# Altium schematic sheet K4S561632.SchDoc
size A
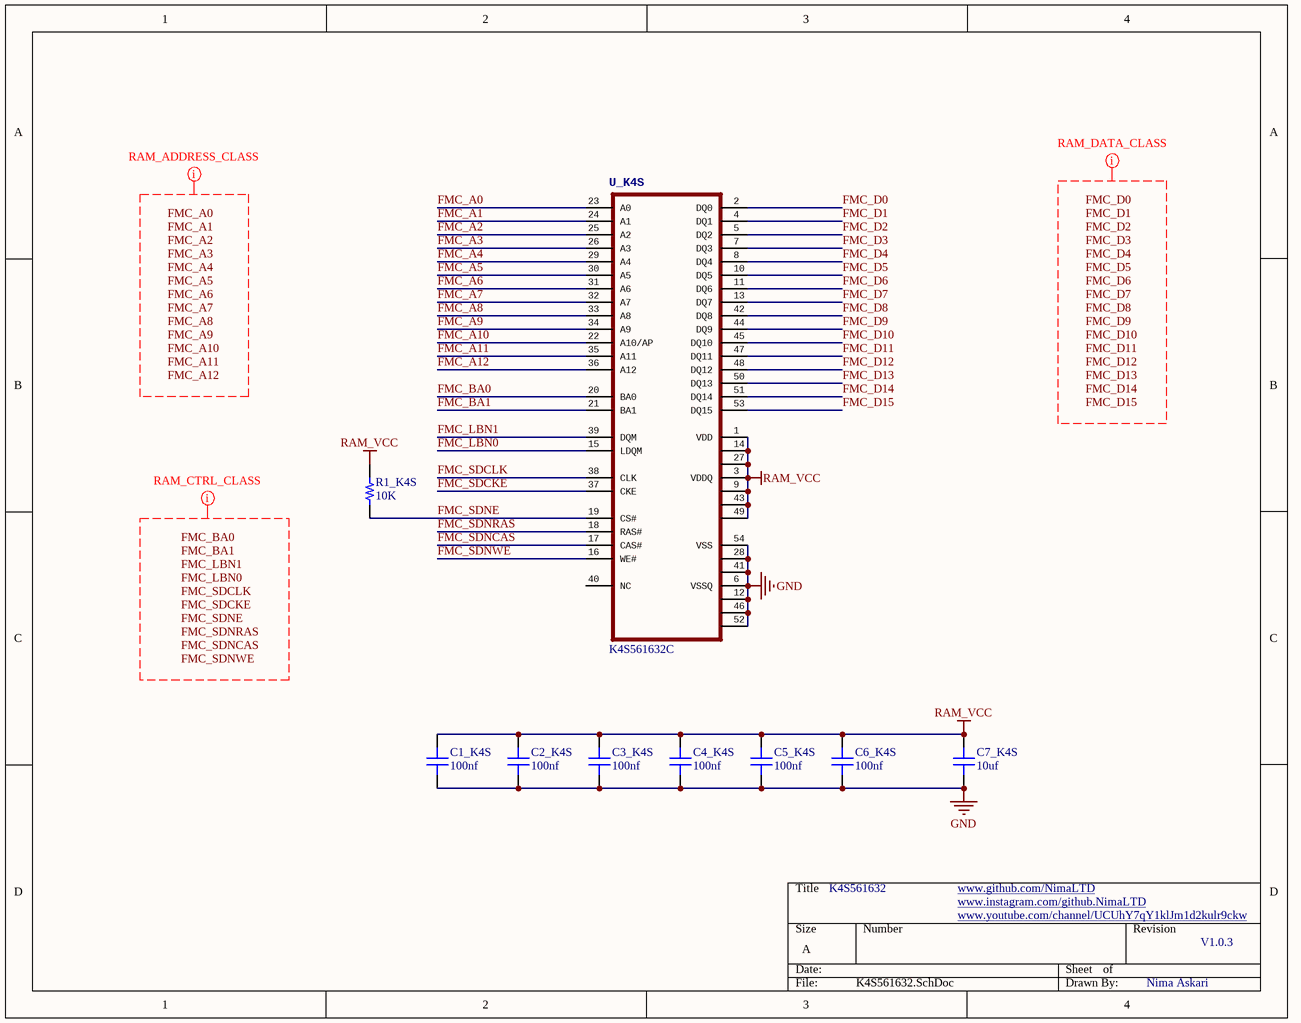
[diagram p0: K4S561632.SchDoc]

## Parts
C1_K4S  100nf  [CAP 0805]
C2_K4S  100nf  [CAP 0805]
C3_K4S  100nf  [CAP 0805]
C4_K4S  100nf  [CAP 0805]
C5_K4S  100nf  [CAP 0805]
C6_K4S  100nf  [CAP 0805]
C7_K4S  10uf  [CAP 0805]
R1_K4S  10K  [RES 0805]
U_K4S  MP: K4S561632C  [TSOP54_P0.8]  (hidden comment: SDRAM   4M x 16bit x 4 banks synchronous DRAM. 256 Mbit SDRAM.)

## Nets
GND: C1_K4S.1 C2_K4S.1 C3_K4S.1 C4_K4S.1 C5_K4S.1 C6_K4S.1 C7_K4S.1 U_K4S.6(VSSQ) U_K4S.12(VSSQ@12) U_K4S.28(VSS@28) U_K4S.41(VSS@41) U_K4S.46(VSSQ@46) U_K4S.52(VSSQ@52) U_K4S.54(VSS)
RAM_VCC: C1_K4S.2 C2_K4S.2 C3_K4S.2 C4_K4S.2 C5_K4S.2 C6_K4S.2 C7_K4S.2 R1_K4S.2 U_K4S.1(VDD) U_K4S.3(VDDQ) U_K4S.9(VDDQ@9) U_K4S.14(VDD@14) U_K4S.27(VDD@27) U_K4S.43(VDDQ@43) U_K4S.49(VDDQ@49)
FMC_A0: U_K4S.23(A0)
FMC_A1: U_K4S.24(A1)
FMC_A2: U_K4S.25(A2)
FMC_A3: U_K4S.26(A3)
FMC_A4: U_K4S.29(A4)
FMC_A5: U_K4S.30(A5)
FMC_A6: U_K4S.31(A6)
FMC_A7: U_K4S.32(A7)
FMC_A8: U_K4S.33(A8)
FMC_A9: U_K4S.34(A9)
FMC_A10: U_K4S.22(A10/AP)
FMC_A11: U_K4S.35(A11)
FMC_A12: U_K4S.36(A12)
FMC_BA0: U_K4S.20(BA0)
FMC_BA1: U_K4S.21(BA1)
FMC_D0: U_K4S.2(DQ0)
FMC_D1: U_K4S.4(DQ1)
FMC_D2: U_K4S.5(DQ2)
FMC_D3: U_K4S.7(DQ3)
FMC_D4: U_K4S.8(DQ4)
FMC_D5: U_K4S.10(DQ5)
FMC_D6: U_K4S.11(DQ6)
FMC_D7: U_K4S.13(DQ7)
FMC_D8: U_K4S.42(DQ8)
FMC_D9: U_K4S.44(DQ9)
FMC_D10: U_K4S.45(DQ10)
FMC_D11: U_K4S.47(DQ11)
FMC_D12: U_K4S.48(DQ12)
FMC_D13: U_K4S.50(DQ13)
FMC_D14: U_K4S.51(DQ14)
FMC_D15: U_K4S.53(DQ15)
FMC_LBN0: U_K4S.15(LDQM)
FMC_LBN1: U_K4S.39(DQM)
FMC_SDCKE: U_K4S.37(CKE)
FMC_SDCLK: U_K4S.38(CLK)
FMC_SDNCAS: U_K4S.17(CAS#)
FMC_SDNE: R1_K4S.1 U_K4S.19(CS#)
FMC_SDNRAS: U_K4S.18(RAS#)
FMC_SDNWE: U_K4S.16(WE#)

Not connected (* = marked no-connect by the designer): U_K4S 40(NC)

## Layout directives
rule Matched Net Lengths [Tolerance = 0.2mm]; net class RAM_DATA_CLASS: FMC_D0, FMC_D1, FMC_D2, FMC_D3, FMC_D4, FMC_D5, FMC_D6, FMC_D7, FMC_D8, FMC_D9, FMC_D10, FMC_D11, FMC_D12, FMC_D13, FMC_D14, FMC_D15
net class RAM_ADDRESS_CLASS; rule Matched Net Lengths [Tolerance = 0.2mm]: FMC_A0, FMC_A1, FMC_A2, FMC_A3, FMC_A4, FMC_A5, FMC_A6, FMC_A7, FMC_A8, FMC_A9, FMC_A10, FMC_A11, FMC_A12
net class RAM_CTRL_CLASS; rule Matched Net Lengths [Tolerance = 0.2mm]: FMC_BA0, FMC_BA1, FMC_LBN0, FMC_LBN1, FMC_SDCKE, FMC_SDCLK, FMC_SDNCAS, FMC_SDNE, FMC_SDNRAS, FMC_SDNWE

## Notes on the sheet
- K4S561632
- www.github.com/NimaLTD <http://www.github.com/NimaLTD>
- www.instagram.com/github.NimaLTD <http://www.instagram.com/github.NimaLTD>
- www.youtube.com/channel/UCUhY7qY1klJm1d2kulr9ckw <http://www.youtube.com/channel/UCUhY7qY1klJm1d2kulr9ckw>
- V1.0.3
- Nima Askari
- Labels drawn without touching a wire or pin: FMC_A0, FMC_A1, FMC_A2, FMC_A3, FMC_A4, FMC_A5, FMC_A6, FMC_A7, FMC_A8, FMC_A9, FMC_A10, FMC_A11, FMC_A12, FMC_BA0, FMC_BA1, FMC_D0, FMC_D1, FMC_D2, FMC_D3, FMC_D4, FMC_D5, FMC_D6, FMC_D7, FMC_D8, FMC_D9, FMC_D10, FMC_D11, FMC_D12, FMC_D13, FMC_D14, FMC_D15, FMC_LBN0, FMC_LBN1, FMC_SDCKE, FMC_SDCLK, FMC_SDNCAS, FMC_SDNE, FMC_SDNRAS, FMC_SDNWE

## Library data of the parts
C1_K4S C2_K4S C3_K4S C4_K4S C5_K4S C6_K4S C7_K4S = Cap SMD 0805: SMT Capacitor
  C1_K4S C2_K4S C3_K4S C4_K4S C5_K4S C6_K4S: Value: 100nf
  C7_K4S: Value: 10uf
R1_K4S = Res SMD 0805: SMD Resistor; Value: 10K
U_K4S = K4S561632E-TC